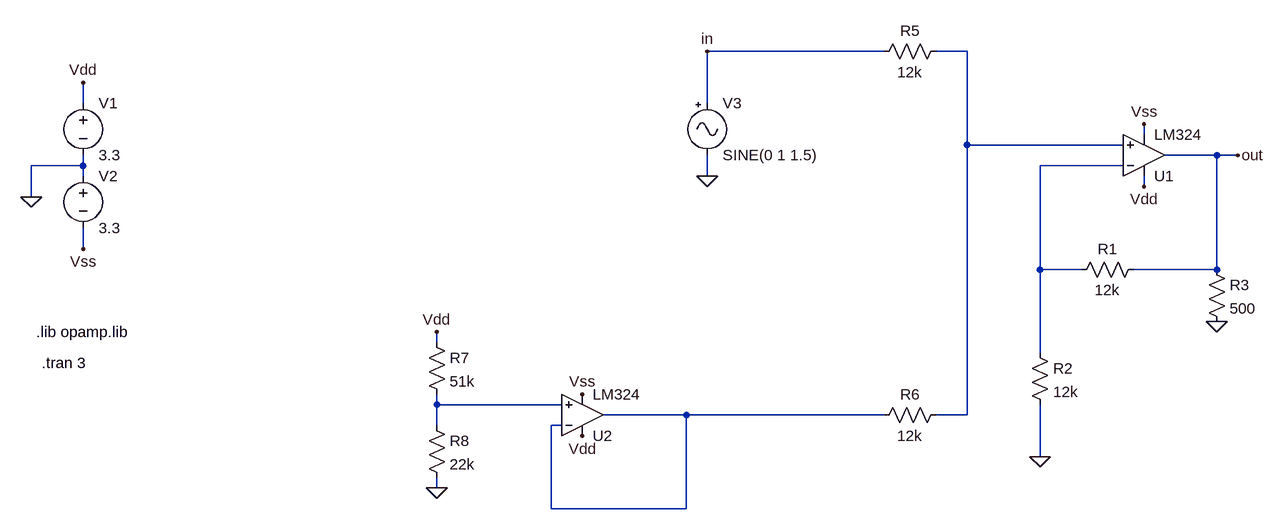
[diagram p0: schematic somador2.asc]
somador2.asc, the LTspice schematic file:
Version 4
SHEET 1 1464 940
WIRE -32 -416 -304 -416
WIRE 96 -416 48 -416
WIRE -1264 -336 -1264 -368
WIRE -304 -336 -304 -416
WIRE 368 -288 368 -304
WIRE 96 -272 96 -416
WIRE 336 -272 96 -272
WIRE 480 -256 400 -256
WIRE 512 -256 480 -256
WIRE -1264 -240 -1264 -256
WIRE -1264 -240 -1344 -240
WIRE 336 -240 208 -240
WIRE -1264 -224 -1264 -240
WIRE -304 -224 -304 -256
WIRE 368 -208 368 -224
WIRE -1344 -192 -1344 -240
WIRE -1264 -112 -1264 -144
WIRE 208 -80 208 -240
WIRE 272 -80 208 -80
WIRE 480 -80 480 -256
WIRE 480 -80 352 -80
WIRE -720 32 -720 16
WIRE 208 48 208 -80
WIRE -720 128 -720 112
WIRE -528 128 -720 128
WIRE -336 144 -464 144
WIRE -32 144 -336 144
WIRE 96 144 96 -272
WIRE 96 144 48 144
WIRE -720 160 -720 128
WIRE -528 160 -544 160
WIRE 208 208 208 128
WIRE -720 256 -720 240
WIRE -544 288 -544 160
WIRE -336 288 -336 144
WIRE -336 288 -544 288
FLAG -1344 -192 0
FLAG -1264 -368 Vdd
FLAG 368 -208 Vdd
FLAG 368 -304 Vss
FLAG -1264 -112 Vss
FLAG -304 -224 0
FLAG 512 -256 out
FLAG -304 -416 in
FLAG 208 208 0
FLAG -720 256 0
FLAG -720 16 Vdd
FLAG 480 0 0
FLAG -496 176 Vdd
FLAG -496 112 Vss
SYMBOL voltage -1264 -352 R0
SYMATTR InstName V1
SYMATTR Value 3.3
SYMBOL voltage -1264 -240 R0
SYMATTR InstName V2
SYMATTR Value 3.3
SYMBOL res 368 -96 R90
WINDOW 0 0 56 VBottom 2
WINDOW 3 32 56 VTop 2
SYMATTR InstName R1
SYMATTR Value 12k
SYMBOL Opamps\\opamp2 368 -192 M180
SYMATTR InstName U1
SYMATTR Value LM324
SYMBOL res 192 32 R0
SYMATTR InstName R2
SYMATTR Value 12k
SYMBOL res 64 -432 R90
WINDOW 0 0 56 VBottom 2
WINDOW 3 32 56 VTop 2
SYMATTR InstName R5
SYMATTR Value 12k
SYMBOL res 64 128 R90
WINDOW 0 0 56 VBottom 2
WINDOW 3 32 56 VTop 2
SYMATTR InstName R6
SYMATTR Value 12k
SYMBOL res -736 16 R0
SYMATTR InstName R7
SYMATTR Value 51k
SYMBOL res -736 144 R0
SYMATTR InstName R8
SYMATTR Value 22k
SYMBOL Misc\\signal -304 -352 R0
SYMATTR InstName V3
SYMATTR Value SINE(0 1 1.5)
SYMBOL res 464 -96 R0
SYMATTR InstName R3
SYMATTR Value 500
SYMBOL Opamps\\opamp2 -496 208 M180
SYMATTR InstName U2
SYMATTR Value LM324
TEXT -1336 16 Left 2 !.lib opamp.lib
TEXT -1328 64 Left 2 !.tran 3

The netlist it stands for:
* somador2.asc
V1 Vdd 0 3.3
V2 0 Vss 3.3
R1 out N002 12k
XU1 N001 N002 Vdd Vss out LM324  ; pins In+ In- V+ V- OUT
R2 N002 0 12k
R5 N001 in 12k
R6 N001 N004 12k
R7 Vdd N003 51k
R8 N003 0 22k
V3 in 0 SINE(0 1 1.5)
R3 out 0 500
XU2 N003 N004 Vdd Vss N004 LM324  ; pins In+ In- V+ V- OUT
.lib opamp.lib
.tran 3
.backanno
.end